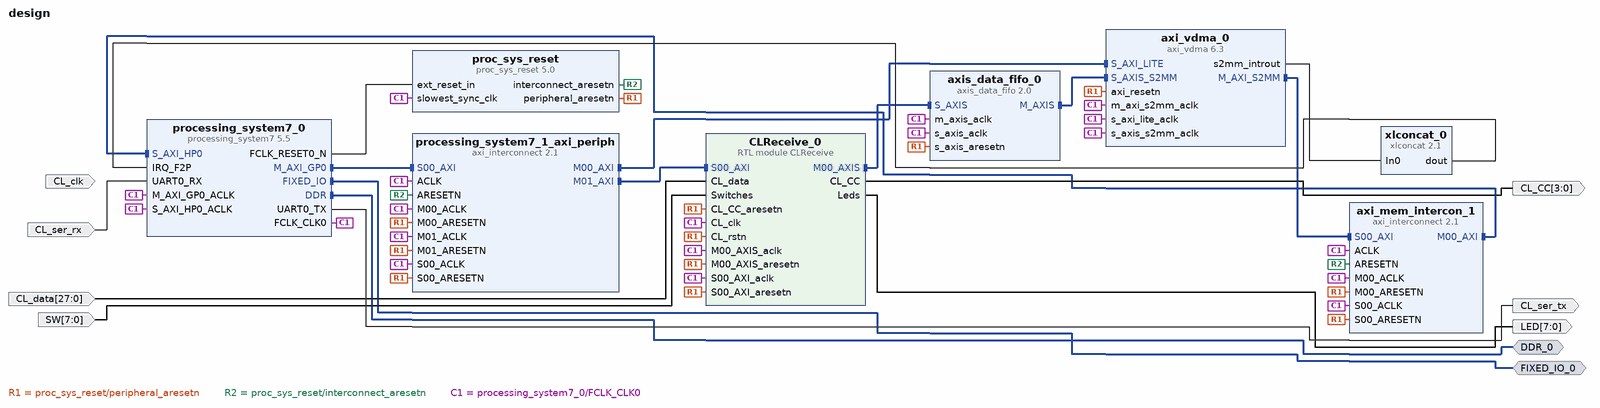
[diagram p0: block diagram of the top level]
# Vivado block design design, xc7z020clg484-1, Vivado 2020.1
create_bd_design design

create_bd_intf_port -mode Master -vlnv xilinx.com:interface:ddrx_rtl:1.0 DDR_0
create_bd_intf_port -mode Master -vlnv xilinx.com:display_processing_system7:fixedio_rtl:1.0 FIXED_IO_0
create_bd_port -dir I -type clk CL_clk
set_property -dict {CONFIG.FREQ_HZ 85000000} [get_bd_ports CL_clk]
create_bd_port -dir I -from 27 -to 0 -type data CL_data
create_bd_port -dir O -type data CL_ser_tx
create_bd_port -dir I CL_ser_rx
create_bd_port -dir I -from 7 -to 0 SW
create_bd_port -dir O -from 7 -to 0 LED
create_bd_port -dir O -from 3 -to 0 -type clk CL_CC

create_bd_cell -type ip -vlnv xilinx.com:ip:axi_interconnect:2.1 axi_mem_intercon_1
set_property -dict {CONFIG.NUM_MI 1 CONFIG.SYNCHRONIZATION_STAGES 2} [get_bd_cells axi_mem_intercon_1]
create_bd_cell -type ip -vlnv xilinx.com:ip:axi_interconnect:2.1 processing_system7_1_axi_periph
set_property -dict {CONFIG.NUM_MI 2 CONFIG.SYNCHRONIZATION_STAGES 2} [get_bd_cells processing_system7_1_axi_periph]
create_bd_cell -type ip -vlnv xilinx.com:ip:xlconcat:2.1 xlconcat_0
set_property -dict {CONFIG.NUM_PORTS 1 CONFIG.dout_width 1} [get_bd_cells xlconcat_0]
create_bd_cell -type ip -vlnv xilinx.com:ip:proc_sys_reset:5.0 proc_sys_reset
set_property -dict {CONFIG.C_AUX_RESET_HIGH 0 CONFIG.C_EXT_RESET_HIGH 0} [get_bd_cells proc_sys_reset]
create_bd_cell -type ip -vlnv xilinx.com:ip:processing_system7:5.5 processing_system7_0
set_property -dict [list \
  CONFIG.PCW_APU_PERIPHERAL_FREQMHZ 666.666666 \
  CONFIG.PCW_ENET0_PERIPHERAL_ENABLE 0 \
  CONFIG.PCW_FPGA0_PERIPHERAL_FREQMHZ 100 \
  CONFIG.PCW_GPIO_MIO_GPIO_ENABLE 1 \
  CONFIG.PCW_GPIO_MIO_GPIO_IO MIO \
  CONFIG.PCW_I2C_RESET_ENABLE 1 \
  CONFIG.PCW_IRQ_F2P_INTR 1 \
  CONFIG.PCW_PRESET_BANK0_VOLTAGE {LVCMOS 1.8V} \
  CONFIG.PCW_PRESET_BANK1_VOLTAGE {LVCMOS 1.8V} \
  CONFIG.PCW_QSPI_GRP_FBCLK_ENABLE 1 \
  CONFIG.PCW_QSPI_GRP_FBCLK_IO {MIO 8} \
  CONFIG.PCW_QSPI_GRP_SINGLE_SS_ENABLE 1 \
  CONFIG.PCW_QSPI_GRP_SINGLE_SS_IO {MIO 1 .. 6} \
  CONFIG.PCW_QSPI_PERIPHERAL_ENABLE 1 \
  CONFIG.PCW_QSPI_QSPI_IO {MIO 1 .. 6} \
  CONFIG.PCW_SD0_PERIPHERAL_ENABLE 0 \
  CONFIG.PCW_SINGLE_QSPI_DATA_MODE x4 \
  CONFIG.PCW_TTC0_PERIPHERAL_ENABLE 1 \
  CONFIG.PCW_TTC0_TTC0_IO EMIO \
  CONFIG.PCW_UART0_PERIPHERAL_ENABLE 1 \
  CONFIG.PCW_UART0_UART0_IO EMIO \
  CONFIG.PCW_UART1_PERIPHERAL_ENABLE 1 \
  CONFIG.PCW_UART1_UART1_IO {MIO 48 .. 49} \
  CONFIG.PCW_UART_PERIPHERAL_FREQMHZ 50 \
  CONFIG.PCW_UIPARAM_DDR_FREQ_MHZ 533.333333 \
  CONFIG.PCW_UIPARAM_DDR_PARTNO {MT41J256M8 HX-15E} \
  CONFIG.PCW_USB0_PERIPHERAL_ENABLE 0 \
  CONFIG.PCW_USB_RESET_ENABLE 1 \
  CONFIG.PCW_USE_FABRIC_INTERRUPT 1 \
  CONFIG.PCW_USE_S_AXI_HP0 1 \
  CONFIG.preset ZC702 \
] [get_bd_cells processing_system7_0]
# 225 more settings of processing_system7_0 are not shown: defaults, MIO pin electricals, DDR timing, and values the tool derives
create_bd_cell -type ip -vlnv xilinx.com:ip:axi_vdma:6.3 axi_vdma_0
set_property -dict [list \
  CONFIG.c_include_mm2s 0 \
  CONFIG.c_s2mm_linebuffer_depth 4096 \
  CONFIG.c_use_s2mm_fsync 2 \
] [get_bd_cells axi_vdma_0]
create_bd_cell -type module -reference CLReceive CLReceive_0
create_bd_cell -type ip -vlnv xilinx.com:ip:axis_data_fifo:2.0 axis_data_fifo_0
set_property -dict {CONFIG.FIFO_DEPTH 16 CONFIG.IS_ACLK_ASYNC 1 CONFIG.SYNCHRONIZATION_STAGES 2} [get_bd_cells axis_data_fifo_0]

# ---- connections ----

connect_bd_intf_net [get_bd_intf_pins axi_vdma_0/M_AXI_S2MM] [get_bd_intf_pins axi_mem_intercon_1/S00_AXI]
connect_bd_intf_net [get_bd_intf_ports FIXED_IO_0] [get_bd_intf_pins processing_system7_0/FIXED_IO]
connect_bd_intf_net [get_bd_intf_pins processing_system7_1_axi_periph/S00_AXI] [get_bd_intf_pins processing_system7_0/M_AXI_GP0]
connect_bd_intf_net [get_bd_intf_ports DDR_0] [get_bd_intf_pins processing_system7_0/DDR]
connect_bd_intf_net [get_bd_intf_pins axi_mem_intercon_1/M00_AXI] [get_bd_intf_pins processing_system7_0/S_AXI_HP0]
connect_bd_intf_net [get_bd_intf_pins CLReceive_0/S00_AXI] [get_bd_intf_pins processing_system7_1_axi_periph/M01_AXI]
connect_bd_intf_net [get_bd_intf_pins axi_vdma_0/S_AXI_LITE] [get_bd_intf_pins processing_system7_1_axi_periph/M00_AXI]
connect_bd_intf_net [get_bd_intf_pins axis_data_fifo_0/M_AXIS] [get_bd_intf_pins axi_vdma_0/S_AXIS_S2MM]
connect_bd_intf_net [get_bd_intf_pins CLReceive_0/M00_AXIS] [get_bd_intf_pins axis_data_fifo_0/S_AXIS]
connect_bd_net [get_bd_pins proc_sys_reset/peripheral_aresetn] \
  [get_bd_pins axi_mem_intercon_1/S00_ARESETN] [get_bd_pins axi_mem_intercon_1/M00_ARESETN] \
  [get_bd_pins processing_system7_1_axi_periph/S00_ARESETN] [get_bd_pins processing_system7_1_axi_periph/M00_ARESETN] \
  [get_bd_pins processing_system7_1_axi_periph/M01_ARESETN] [get_bd_pins axi_vdma_0/axi_resetn] \
  [get_bd_pins CLReceive_0/S00_AXI_aresetn] [get_bd_pins CLReceive_0/CL_rstn] [get_bd_pins CLReceive_0/CL_CC_aresetn] \
  [get_bd_pins CLReceive_0/M00_AXIS_aresetn] [get_bd_pins axis_data_fifo_0/s_axis_aresetn]
connect_bd_net [get_bd_pins proc_sys_reset/interconnect_aresetn] \
  [get_bd_pins axi_mem_intercon_1/ARESETN] [get_bd_pins processing_system7_1_axi_periph/ARESETN]
connect_bd_net [get_bd_pins xlconcat_0/dout] [get_bd_pins processing_system7_0/IRQ_F2P]
connect_bd_net [get_bd_pins processing_system7_0/FCLK_RESET0_N] [get_bd_pins proc_sys_reset/ext_reset_in]
connect_bd_net [get_bd_pins processing_system7_0/FCLK_CLK0] \
  [get_bd_pins axi_mem_intercon_1/S00_ACLK] [get_bd_pins processing_system7_1_axi_periph/M00_ACLK] \
  [get_bd_pins axi_mem_intercon_1/ACLK] [get_bd_pins axi_mem_intercon_1/M00_ACLK] \
  [get_bd_pins processing_system7_0/S_AXI_HP0_ACLK] [get_bd_pins processing_system7_1_axi_periph/M01_ACLK] \
  [get_bd_pins proc_sys_reset/slowest_sync_clk] [get_bd_pins processing_system7_1_axi_periph/S00_ACLK] \
  [get_bd_pins processing_system7_1_axi_periph/ACLK] [get_bd_pins processing_system7_0/M_AXI_GP0_ACLK] \
  [get_bd_pins axi_vdma_0/s_axi_lite_aclk] [get_bd_pins CLReceive_0/S00_AXI_aclk] [get_bd_pins axi_vdma_0/s_axis_s2mm_aclk] \
  [get_bd_pins axi_vdma_0/m_axi_s2mm_aclk] [get_bd_pins axis_data_fifo_0/m_axis_aclk] \
  [get_bd_pins axis_data_fifo_0/s_axis_aclk] [get_bd_pins CLReceive_0/M00_AXIS_aclk] [get_bd_pins CLReceive_0/CL_clk]
connect_bd_net -net O2_D_1 [get_bd_ports CL_data] [get_bd_pins CLReceive_0/CL_data]
connect_bd_net -net G_SERFC_1 [get_bd_ports CL_ser_rx] [get_bd_pins processing_system7_0/UART0_RX]
connect_bd_net [get_bd_ports SW] [get_bd_pins CLReceive_0/Switches]
connect_bd_net -net CLReceive_0_CL_serial_tx [get_bd_pins processing_system7_0/UART0_TX] [get_bd_ports CL_ser_tx]
connect_bd_net [get_bd_pins CLReceive_0/Leds] [get_bd_ports LED]
connect_bd_net [get_bd_pins CLReceive_0/CL_CC] [get_bd_ports CL_CC]
connect_bd_net [get_bd_pins axi_vdma_0/s2mm_introut] [get_bd_pins xlconcat_0/In0]

# ---- address map ----
assign_bd_address -offset 0x00000000 -range 1G -target_address_space [get_bd_addr_spaces axi_vdma_0/Data_S2MM] [get_bd_addr_segs processing_system7_0/S_AXI_HP0/HP0_DDR_LOWOCM]
assign_bd_address -offset 0x43000000 -range 64K -target_address_space [get_bd_addr_spaces processing_system7_0/Data] [get_bd_addr_segs axi_vdma_0/S_AXI_LITE/Reg]
assign_bd_address -offset 0x43C00000 -range 64K -target_address_space [get_bd_addr_spaces processing_system7_0/Data] [get_bd_addr_segs CLReceive_0/S00_AXI/reg0]

validate_bd_design
save_bd_design
